# Altium schematic sheet EG_robot.SchDoc: 工程机器人
size A3
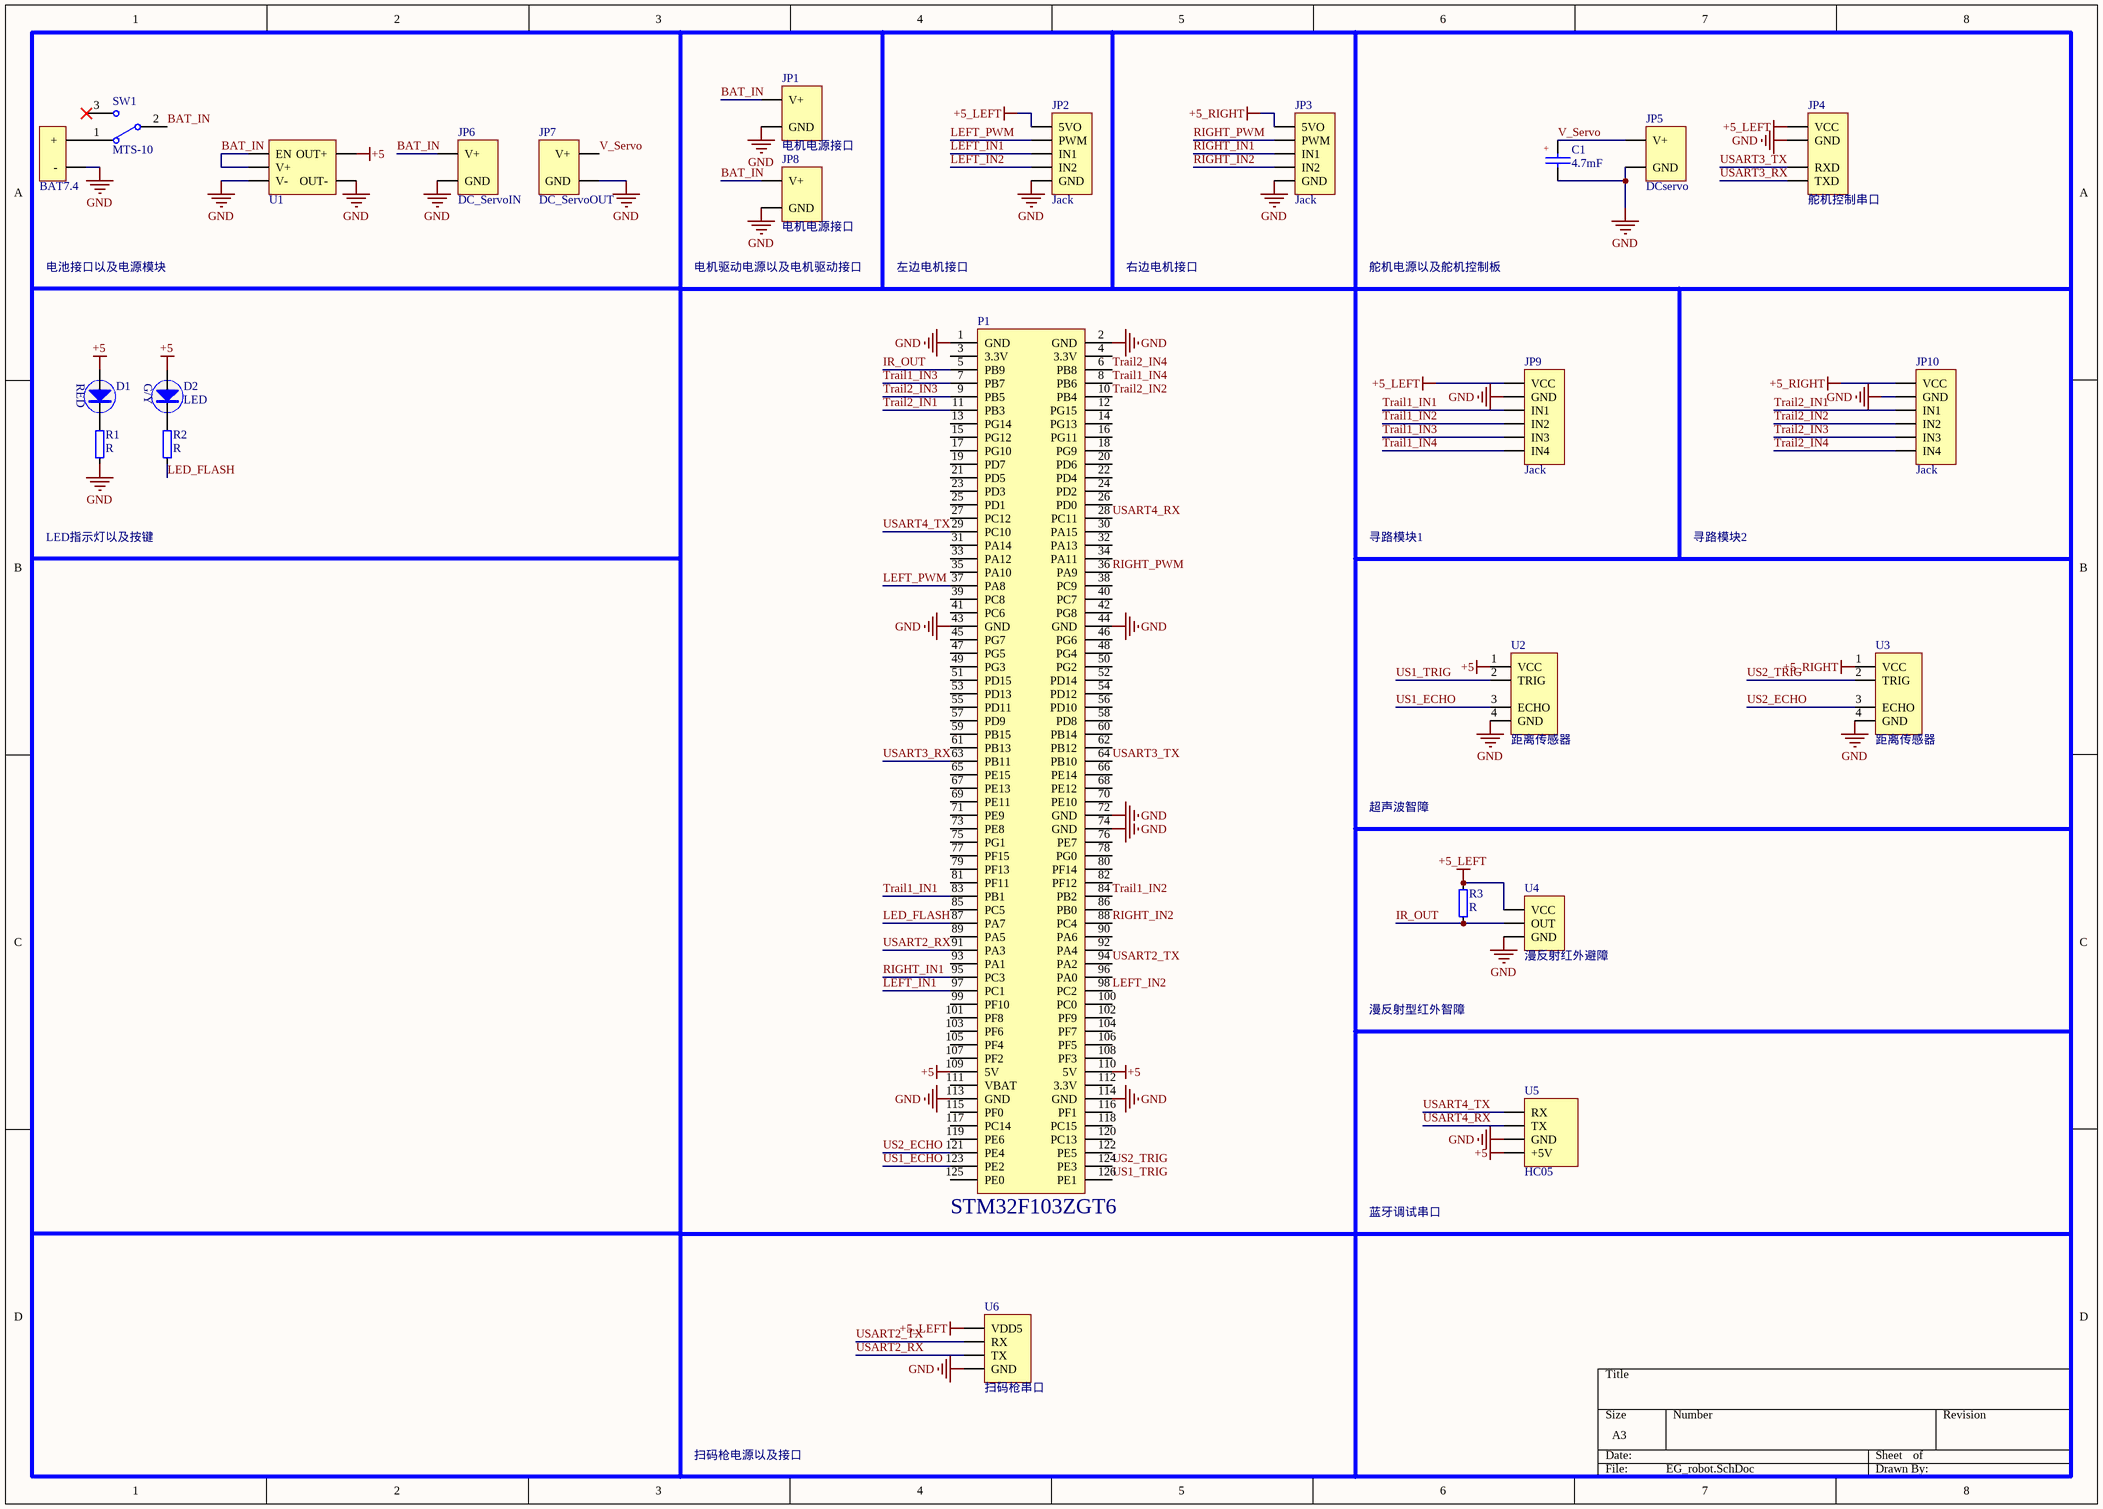
[diagram p0: EG_robot.SchDoc]

## Parts
BAT1  BAT7.4  [POWER]
C1  4.7mF  [CAP 7.5*16*31.5 - BK]
D1  1206LED  [LED 1206R]  (value not drawn)
D2  LED  [LED 1206Y]
JP1  电机电源接口  [SMALL_POWER_JACK]
JP2  Jack  [XH2.54-LI-5P]
JP3  Jack  [XH2.54-LI-5P]
JP4  舵机控制串口  [XH2.54-LI-4P]
JP5  DCservo  [SMALL_POWER_JACK]
JP6  DC_ServoIN  [SMALL_POWER_JACK]
JP7  DC_ServoOUT  [SMALL_POWER_JACK]
JP8  电机电源接口  [SMALL_POWER_JACK]
JP9  Jack  [XH2.54-LI-6P]
JP10  Jack  [XH2.54-LI-6P]
P1  Header 63X2  [YD最小系统版接口]  (value not drawn)
R1  R  [1206R]
R2  R  [1206R]
R3  R  [1206R]
SW1  MTS-10  [MTS-10x]
U1  DC5V  [DC5V_BUCKBOOST]  (value not drawn)
U2  距离传感器  [XH2.54-LI-4P]
U3  距离传感器  [XH2.54-LI-4P]
U4  漫反射红外避障  [XH2.54-LI-3P]
U5  HC05  [XH2.54-LI-4P]
U6  扫码枪串口  [XH2.54-LI-4P]

## Nets
+5: D1.1(A) D2.1(A) P1.109(5V) P1.110(5V) U1.2(OUT+) U2.1(VCC) U5.4(+5V)
+5_LEFT: JP2.1(5VO) JP4.1(VCC) JP9.1(VCC) R3.2 U4.1(VCC) U6.1(VDD5)
+5_RIGHT: JP3.1(5VO) JP10.1(VCC) U3.1(VCC)
GND: BAT1.2(-) C1.2 JP1.2(GND) JP2.5(GND) JP3.5(GND) JP4.2(GND) JP5.2(GND) JP6.2(GND) JP7.2(GND) JP8.2(GND) JP9.2(GND) JP10.2(GND) P1.1(GND) P1.2(GND) P1.43(GND) P1.44(GND) P1.72(GND) P1.74(GND) P1.113(GND) P1.114(GND) R1.1 U1.1(OUT-) U1.5(V-) U2.4(GND) U3.4(GND) U4.3(GND) U5.3(GND) U6.4(GND)
BAT_IN: JP1.1(V+) JP6.1(V+) JP8.1(V+) SW1.2 U1.3(EN) U1.4(V+)
IR_OUT: P1.5(PB9) R3.1 U4.2(OUT)
LED_FLASH: P1.87(PA7) R2.1
LEFT_IN1: JP2.3(IN1) P1.97(PC1)
LEFT_IN2: JP2.4(IN2) P1.98(PC2)
LEFT_PWM: JP2.2(PWM) P1.37(PA8)
RIGHT_IN1: JP3.3(IN1) P1.95(PC3)
RIGHT_IN2: JP3.4(IN2) P1.88(PC4)
RIGHT_PWM: JP3.2(PWM) P1.36(PA9)
Trail1_IN1: JP9.3(IN1) P1.83(PB1)
Trail1_IN2: JP9.4(IN2) P1.84(PB2)
Trail1_IN3: JP9.5(IN3) P1.7(PB7)
Trail1_IN4: JP9.6(IN4) P1.8(PB6)
Trail2_IN1: JP10.3(IN1) P1.11(PB3)
Trail2_IN2: JP10.4(IN2) P1.10(PB4)
Trail2_IN3: JP10.5(IN3) P1.9(PB5)
Trail2_IN4: JP10.6(IN4) P1.6(PB8)
US1_ECHO: P1.123(PE2) U2.3(ECHO)
US1_TRIG: P1.126(PE1) U2.2(TRIG)
US2_ECHO: P1.121(PE4) U3.3(ECHO)
US2_TRIG: P1.124(PE3) U3.2(TRIG)
USART2_RX: P1.91(PA3) U6.3(TX)
USART2_TX: P1.94(PA2) U6.2(RX)
USART3_RX: JP4.4(TXD) P1.63(PB11)
USART3_TX: JP4.3(RXD) P1.64(PB10)
USART4_RX: P1.28(PC11) U5.2(TX)
USART4_TX: P1.29(PC10) U5.1(RX)
V_Servo: C1.1 JP5.1(V+) JP7.1(V+)
NetBAT1_1: BAT1.1(+) SW1.1
NetD1_2: D1.2(K) R1.2
NetD2_2: D2.2(K) R2.2

Not connected (* = marked no-connect by the designer): P1 3(3.3V) 4(3.3V) 12(PG15) 13(PG14) 14(PG13) 15(PG12) 16(PG11) 17(PG10) 18(PG9) 19(PD7) 20(PD6) 21(PD5) 22(PD4) 23(PD3) 24(PD2) 25(PD1) 26(PD0) 27(PC12) 30(PA15) 31(PA14) 32(PA13) 33(PA12) 34(PA11) 35(PA10) 38(PC9) 39(PC8) 40(PC7) 41(PC6) 42(PG8) 45(PG7) 46(PG6) 47(PG5) 48(PG4) 49(PG3) 50(PG2) 51(PD15) 52(PD14) 53(PD13) 54(PD12) 55(PD11) 56(PD10) 57(PD9) 58(PD8) 59(PB15) 60(PB14) 61(PB13) 62(PB12) 65(PE15) 66(PE14) 67(PE13) 68(PE12) 69(PE11) 70(PE10) 71(PE9) 73(PE8) 75(PG1) 76(PE7) 77(PF15) 78(PG0) 79(PF13) 80(PF14) 81(PF11) 82(PF12) 85(PC5) 86(PB0) 89(PA5) 90(PA6) 92(PA4) 93(PA1) 96(PA0) 99(PF10) 100(PC0) 101(PF8) 102(PF9) 103(PF6) 104(PF7) 105(PF4) 106(PF5) 107(PF2) 108(PF3) 111(VBAT) 112(3.3V) 115(PF0) 116(PF1) 117(PC14) 118(PC15) 119(PE6) 120(PC13) 122(PE5) 125(PE0); SW1 3*

## Notes on the sheet
- 电池接口以及电源模块
- 电机驱动电源以及电机驱动接口
- 左边电机接口
- 右边电机接口
- 舵机电源以及舵机控制板
- LED指示灯以及按键
- 寻路模块1
- 寻路模块2
- 超声波智障
- 漫反射型红外智障
- (near P1) STM32F103ZGT6
- 蓝牙调试串口
- 扫码枪电源以及接口
- (in symbol CAP_DIP7.6*16.35) +
- (in symbol LED_GY) G/Y
- (in symbol LED_RED) RED

## Library data of the parts
BAT1 = POWER_COM
C1 = CAP_DIP7.6*16.35: 7.6*16*35
D1 = LED_RED: LED
D2 = LED_GY
JP1 JP8 = DC_moto
JP2 JP3 = Moto: White Small
JP5 = DCservo: Power input for Servo Control Board
JP9 JP10 = 循迹模块: White Small
P1 = Header 63X2: Header, 126-Pin, Dual row; LatestRevisionDate: 17-Jul-2002; LatestRevisionNote: Re-released for DXP Platform.; Publisher: Altium Limited
R1-R3 = SMT1206: SMT_1206
SW1 = MTS_10-DIP: MTS-10 series
U1 = DC5V: DC5V Fixed Buck-Boost voltage regulator
U2 U3 = HCSR04: Ultrasonic distant detector
U4 = 红外避障
U6 = 扫码枪